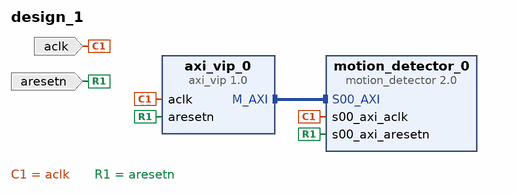
[diagram p0: block diagram of the top level]
# Vivado block design design_1, xc7a200tsbg484-1, Vivado 2017.2
create_bd_design design_1

create_bd_port -dir I -type clk aclk
create_bd_port -dir I -type rst aresetn

create_bd_cell -type ip -vlnv xilinx.com:ip:axi_vip:1.0 axi_vip_0
set_property -dict [list \
  CONFIG.PROTOCOL AXI4LITE \
  CONFIG.READ_WRITE_MODE READ_WRITE \
  CONFIG.INTERFACE_MODE MASTER \
  CONFIG.ADDR_WIDTH 32 \
  CONFIG.DATA_WIDTH 32 \
  CONFIG.WUSER_BITS_PER_BYTE 0 \
  CONFIG.RUSER_BITS_PER_BYTE 0 \
  CONFIG.HAS_PROT 1 \
  CONFIG.HAS_WSTRB 1 \
  CONFIG.HAS_BRESP 1 \
  CONFIG.HAS_RRESP 1 \
] [get_bd_cells axi_vip_0]
create_bd_cell -type ip -vlnv xilinx.com:user:motion_detector:2.0 motion_detector_0

# ---- connections ----

connect_bd_intf_net [get_bd_intf_pins axi_vip_0/M_AXI] [get_bd_intf_pins motion_detector_0/S00_AXI]
connect_bd_net [get_bd_ports aclk] [get_bd_pins axi_vip_0/aclk] [get_bd_pins motion_detector_0/s00_axi_aclk]
connect_bd_net [get_bd_ports aresetn] [get_bd_pins axi_vip_0/aresetn] [get_bd_pins motion_detector_0/s00_axi_aresetn]

# ---- address map ----
assign_bd_address -offset 0x44A00000 -range 64K -target_address_space [get_bd_addr_spaces axi_vip_0/Master_AXI] [get_bd_addr_segs motion_detector_0/S00_AXI/S00_AXI_reg]

validate_bd_design
save_bd_design
